# EAGLE schematic Main Board v14 (EAGLE 9.7.0)
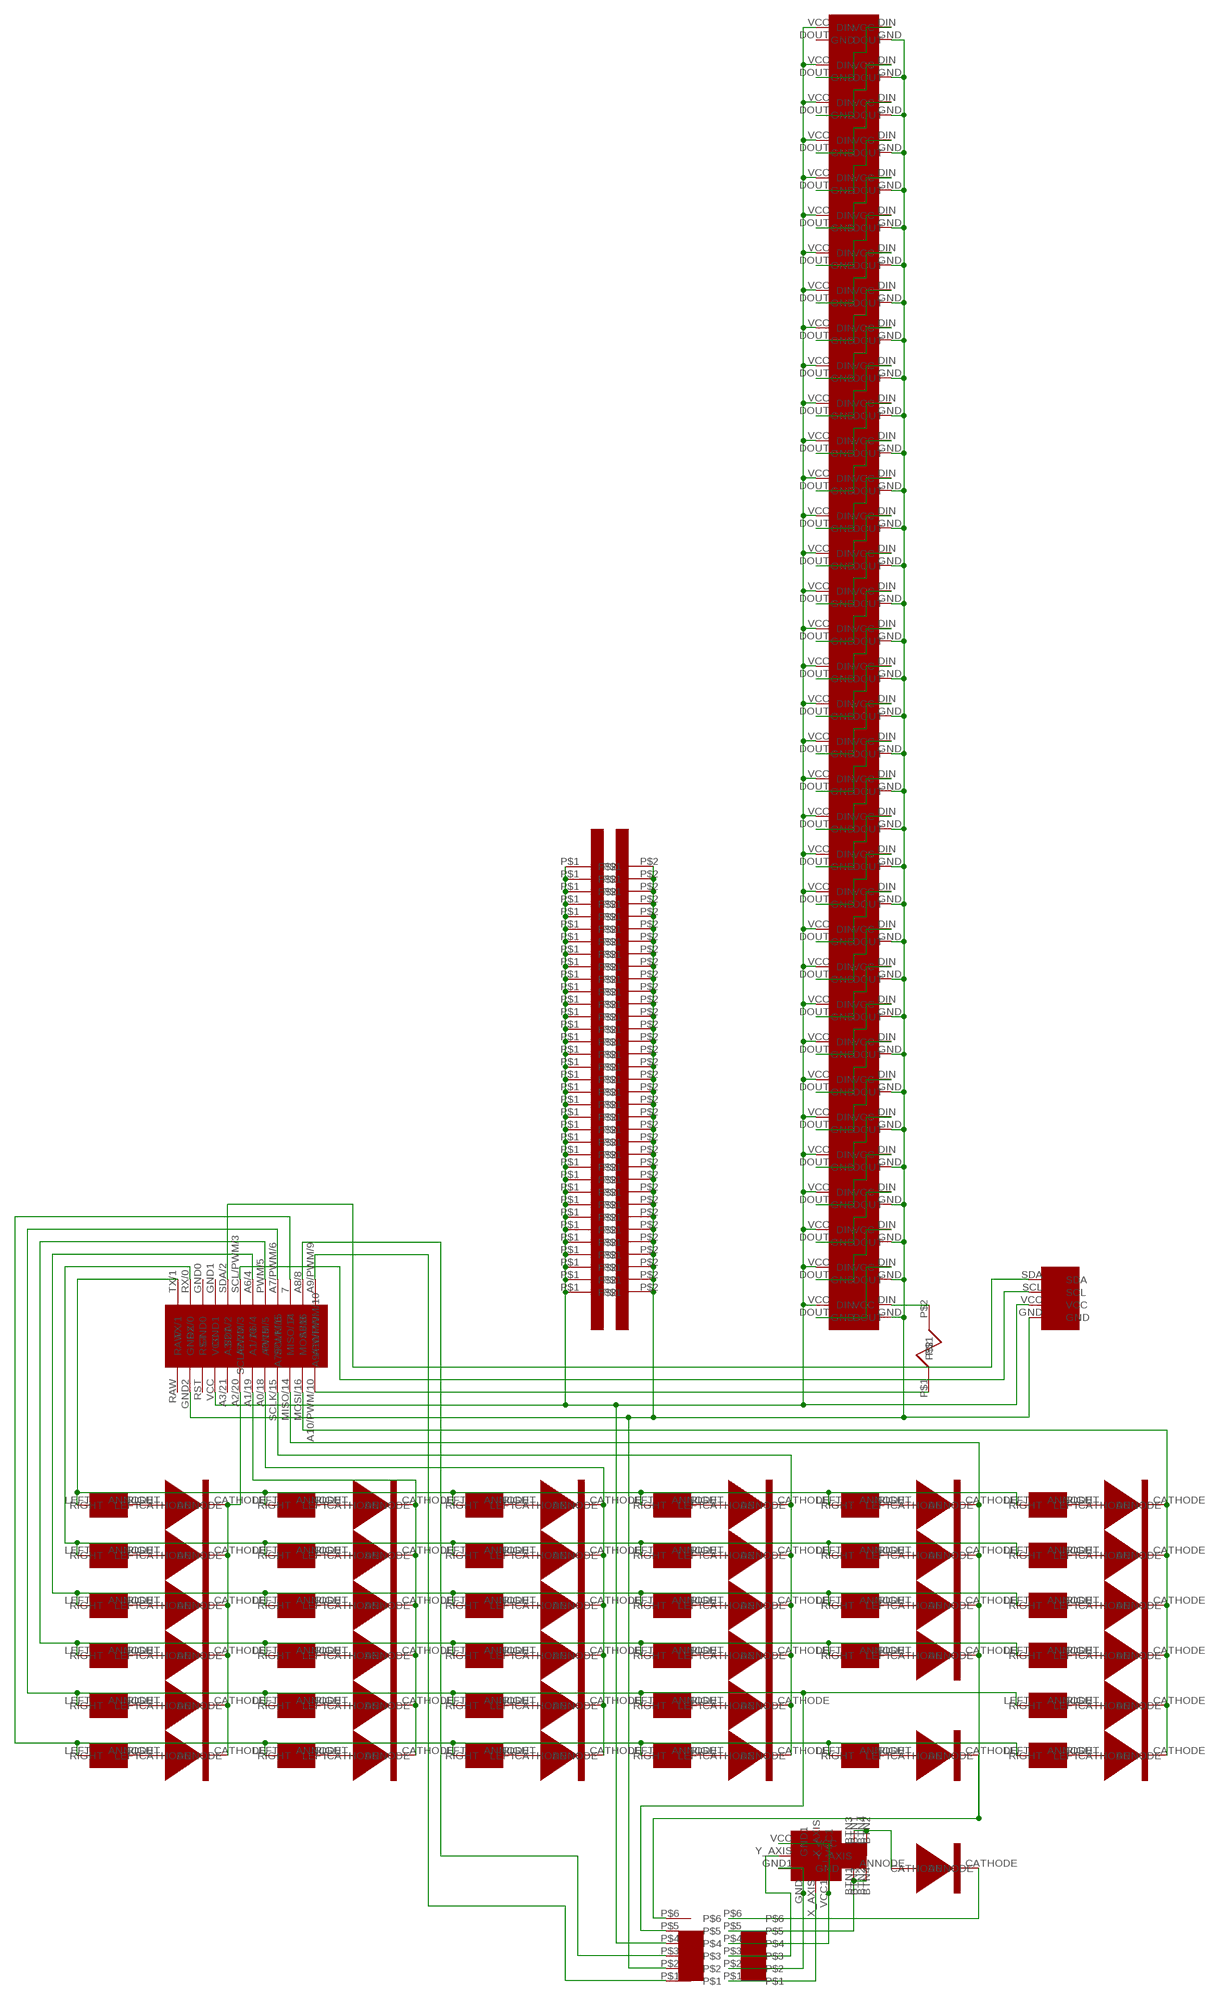
[diagram p0: schematic, sheet 1]

## Parts
1  HOTSWAP_SWITCH  [HOTSWAP_SWITCH]
2  HOTSWAP_SWITCH  [HOTSWAP_SWITCH]
3  HOTSWAP_SWITCH  [HOTSWAP_SWITCH]
4  HOTSWAP_SWITCH  [HOTSWAP_SWITCH]
5  HOTSWAP_SWITCH  [HOTSWAP_SWITCH]
A  HOTSWAP_SWITCH  [HOTSWAP_SWITCH]
ALT  HOTSWAP_SWITCH  [HOTSWAP_SWITCH]
B  HOTSWAP_SWITCH  [HOTSWAP_SWITCH]
C  HOTSWAP_SWITCH  [HOTSWAP_SWITCH]
CAPS  HOTSWAP_SWITCH  [HOTSWAP_SWITCH]
CTRL  HOTSWAP_SWITCH  [HOTSWAP_SWITCH]
D  HOTSWAP_SWITCH  [HOTSWAP_SWITCH]
E  HOTSWAP_SWITCH  [HOTSWAP_SWITCH]
ESC  HOTSWAP_SWITCH  [HOTSWAP_SWITCH]
F  HOTSWAP_SWITCH  [HOTSWAP_SWITCH]
F1  HOTSWAP_SWITCH  [HOTSWAP_SWITCH]
F2  HOTSWAP_SWITCH  [HOTSWAP_SWITCH]
F3  HOTSWAP_SWITCH  [HOTSWAP_SWITCH]
F4  HOTSWAP_SWITCH  [HOTSWAP_SWITCH]
F5  HOTSWAP_SWITCH  [HOTSWAP_SWITCH]
F6  HOTSWAP_SWITCH  [HOTSWAP_SWITCH]
FN  HOTSWAP_SWITCH  [HOTSWAP_SWITCH]
G  HOTSWAP_SWITCH  [HOTSWAP_SWITCH]
NISTOR  ARDUINO_PRO_MICRO  [ARDUINO_PRO_MICRO]
Q  HOTSWAP_SWITCH  [HOTSWAP_SWITCH]
R  HOTSWAP_SWITCH  [HOTSWAP_SWITCH]
S  HOTSWAP_SWITCH  [HOTSWAP_SWITCH]
SHIFT  HOTSWAP_SWITCH  [HOTSWAP_SWITCH]
SPACE  HOTSWAP_SWITCH  [HOTSWAP_SWITCH]
T  HOTSWAP_SWITCH  [HOTSWAP_SWITCH]
TAB  HOTSWAP_SWITCH  [HOTSWAP_SWITCH]
U$1  ANALOG_STICK  [ANALOG_STICK]
U$2  CAPACITOR  [CAPACITOR]
U$4  CAPACITOR  [CAPACITOR]
U$5  CAPACITOR  [CAPACITOR]
U$6  CAPACITOR  [CAPACITOR]
U$7  CAPACITOR  [CAPACITOR]
U$8  DIODE  [DIODE]
U$9  DIODE  [DIODE]
U$10  DIODE  [DIODE]
U$11  DIODE  [DIODE]
U$12  DIODE  [DIODE]
U$13  DIODE  [DIODE]
U$14  CAPACITOR  [CAPACITOR]
U$15  CAPACITOR  [CAPACITOR]
U$16  CAPACITOR  [CAPACITOR]
U$17  CAPACITOR  [CAPACITOR]
U$18  CAPACITOR  [CAPACITOR]
U$19  CAPACITOR  [CAPACITOR]
U$20  DIODE  [DIODE]
U$21  DIODE  [DIODE]
U$22  DIODE  [DIODE]
U$23  DIODE  [DIODE]
U$24  DIODE  [DIODE]
U$25  DIODE  [DIODE]
U$26  CAPACITOR  [CAPACITOR]
U$27  CAPACITOR  [CAPACITOR]
U$28  CAPACITOR  [CAPACITOR]
U$29  CAPACITOR  [CAPACITOR]
U$30  CAPACITOR  [CAPACITOR]
U$31  CAPACITOR  [CAPACITOR]
U$32  DIODE  [DIODE]
U$33  DIODE  [DIODE]
U$34  DIODE  [DIODE]
U$35  DIODE  [DIODE]
U$36  DIODE  [DIODE]
U$37  DIODE  [DIODE]
U$38  CAPACITOR  [CAPACITOR]
U$39  CAPACITOR  [CAPACITOR]
U$40  CAPACITOR  [CAPACITOR]
U$41  CAPACITOR  [CAPACITOR]
U$42  CAPACITOR  [CAPACITOR]
U$43  CAPACITOR  [CAPACITOR]
U$44  DIODE  [DIODE]
U$45  DIODE  [DIODE]
U$46  DIODE  [DIODE]
U$47  DIODE  [DIODE]
U$48  DIODE  [DIODE]
U$49  DIODE  [DIODE]
U$50  CAPACITOR  [CAPACITOR]
U$51  CAPACITOR  [CAPACITOR]
U$52  CAPACITOR  [CAPACITOR]
U$53  CAPACITOR  [CAPACITOR]
U$54  5_PIN_HEADER  [5_PIN_HEADER]
U$55  CAPACITOR  [CAPACITOR]
U$56  DIODE  [DIODE]
U$57  DIODE  [DIODE]
U$58  DIODE  [DIODE]
U$59  DIODE  [DIODE]
U$60  DIODE  [DIODE]
U$61  DIODE  [DIODE]
U$62  CAPACITOR  [CAPACITOR]
U$63  CAPACITOR  [CAPACITOR]
U$64  CAPACITOR  [CAPACITOR]
U$65  CAPACITOR  [CAPACITOR]
U$66  CAPACITOR  [CAPACITOR]
U$67  CAPACITOR  [CAPACITOR]
U$68  DIODE  [DIODE]
U$69  DIODE  [DIODE]
U$70  DIODE  [DIODE]
U$71  DIODE  [DIODE]
U$72  DIODE  [DIODE]
U$73  DIODE  [DIODE]
U$74  CAPACITOR  [CAPACITOR]
U$75  WS2812B  [WS2812B]
U$76  WS2812B  [WS2812B]
U$77  WS2812B  [WS2812B]
U$78  WS2812B  [WS2812B]
U$79  WS2812B  [WS2812B]
U$80  WS2812B  [WS2812B]
U$81  WS2812B  [WS2812B]
U$82  WS2812B  [WS2812B]
U$83  WS2812B  [WS2812B]
U$84  WS2812B  [WS2812B]
U$85  WS2812B  [WS2812B]
U$86  WS2812B  [WS2812B]
U$87  WS2812B  [WS2812B]
U$88  WS2812B  [WS2812B]
U$89  WS2812B  [WS2812B]
U$90  WS2812B  [WS2812B]
U$91  WS2812B  [WS2812B]
U$92  WS2812B  [WS2812B]
U$93  WS2812B  [WS2812B]
U$94  WS2812B  [WS2812B]
U$95  WS2812B  [WS2812B]
U$96  WS2812B  [WS2812B]
U$97  WS2812B  [WS2812B]
U$98  WS2812B  [WS2812B]
U$99  WS2812B  [WS2812B]
U$100  WS2812B  [WS2812B]
U$101  WS2812B  [WS2812B]
U$102  WS2812B  [WS2812B]
U$103  WS2812B  [WS2812B]
U$104  WS2812B  [WS2812B]
U$105  WS2812B  [WS2812B]
U$106  WS2812B  [WS2812B]
U$107  WS2812B  [WS2812B]
U$108  WS2812B  [WS2812B]
U$109  WS2812B  [WS2812B]
U$110  RESISTOR  [RESISTOR]
U$111  OLED_I2C  [OLED_I2C]
U$112  5_PIN_HEADER  [5_PIN_HEADER]
V  HOTSWAP_SWITCH  [HOTSWAP_SWITCH]
W  HOTSWAP_SWITCH  [HOTSWAP_SWITCH]
X  HOTSWAP_SWITCH  [HOTSWAP_SWITCH]
Z  HOTSWAP_SWITCH  [HOTSWAP_SWITCH]
~  HOTSWAP_SWITCH  [HOTSWAP_SWITCH]

## Nets
N$1: U$8.ANNODE ~.RIGHT
N$2: TAB.RIGHT U$9.ANNODE
N$3: CAPS.RIGHT U$10.ANNODE
N$4: SHIFT.RIGHT U$11.ANNODE
N$5: CTRL.RIGHT U$12.ANNODE
N$6: F6.RIGHT U$13.ANNODE
N$7: 1.RIGHT U$20.ANNODE
N$8: Q.RIGHT U$21.ANNODE
N$9: A.RIGHT U$22.ANNODE
N$10: U$23.ANNODE Z.RIGHT
N$11: FN.RIGHT U$24.ANNODE
N$12: F5.RIGHT U$25.ANNODE
N$13: 2.RIGHT U$32.ANNODE
N$14: U$33.ANNODE W.RIGHT
N$15: S.RIGHT U$34.ANNODE
N$16: U$35.ANNODE X.RIGHT
N$17: ALT.RIGHT U$36.ANNODE
N$18: F4.RIGHT U$37.ANNODE
N$19: 3.RIGHT U$44.ANNODE
N$20: E.RIGHT U$45.ANNODE
N$21: D.RIGHT U$46.ANNODE
N$22: C.RIGHT U$47.ANNODE
N$23: SPACE.RIGHT U$48.ANNODE
N$24: F3.RIGHT U$49.ANNODE
N$25: 4.RIGHT U$56.ANNODE
N$26: R.RIGHT U$57.ANNODE
N$27: F.RIGHT U$58.ANNODE
N$28: U$59.ANNODE V.RIGHT
N$29: U$1.BTN1 U$1.BTN2 U$112.P$5
N$30: F2.RIGHT U$61.ANNODE
N$31: 5.RIGHT U$68.ANNODE
N$32: T.RIGHT U$69.ANNODE
N$33: G.RIGHT U$70.ANNODE
N$34: B.RIGHT U$71.ANNODE
N$35: ESC.RIGHT U$72.ANNODE
N$36: F1.RIGHT U$73.ANNODE
N$37: NISTOR.A2/20 U$8.CATHODE U$9.CATHODE U$10.CATHODE U$11.CATHODE U$12.CATHODE U$13.CATHODE
N$38: NISTOR.A1/19 U$20.CATHODE U$21.CATHODE U$22.CATHODE U$23.CATHODE U$24.CATHODE U$25.CATHODE
N$39: NISTOR.A0/18 U$32.CATHODE U$33.CATHODE U$34.CATHODE U$35.CATHODE U$36.CATHODE U$37.CATHODE
N$40: NISTOR.SCLK/15 U$44.CATHODE U$45.CATHODE U$46.CATHODE U$47.CATHODE U$48.CATHODE U$49.CATHODE
N$41: NISTOR.MISO/14 U$54.P$6 U$56.CATHODE U$57.CATHODE U$58.CATHODE U$59.CATHODE U$61.CATHODE
N$42: NISTOR.MOSI/16 U$68.CATHODE U$69.CATHODE U$70.CATHODE U$71.CATHODE U$72.CATHODE U$73.CATHODE
N$43: 1.LEFT 2.LEFT 3.LEFT 4.LEFT 5.LEFT NISTOR.TX/1 ~.LEFT
N$44: E.LEFT NISTOR.RX/0 Q.LEFT R.LEFT T.LEFT TAB.LEFT W.LEFT
N$45: A.LEFT CAPS.LEFT D.LEFT F.LEFT G.LEFT NISTOR.A6/4 S.LEFT
N$46: B.LEFT C.LEFT NISTOR.PWM/5 SHIFT.LEFT V.LEFT X.LEFT Z.LEFT
N$47: U$1.X_AXIS U$112.P$1
N$48: F1.LEFT F2.LEFT F3.LEFT F4.LEFT F5.LEFT F6.LEFT NISTOR.7
N$49: NISTOR.VCC U$2.P$1 U$4.P$1 U$5.P$1 U$6.P$1 U$7.P$1 U$14.P$1 U$15.P$1 U$16.P$1 U$17.P$1 U$18.P$1 U$19.P$1 U$26.P$1 U$27.P$1 U$28.P$1 U$29.P$1 U$30.P$1 U$31.P$1 U$38.P$1 U$39.P$1 U$40.P$1 U$41.P$1 U$42.P$1 U$43.P$1 U$50.P$1 U$51.P$1 U$52.P$1 U$53.P$1 U$54.P$4 U$55.P$1 U$62.P$1 U$63.P$1 U$64.P$1 U$65.P$1 U$66.P$1 U$67.P$1 U$74.P$1 U$75.VCC U$76.VCC U$77.VCC U$78.VCC U$79.VCC U$80.VCC U$81.VCC U$82.VCC U$83.VCC U$84.VCC U$85.VCC U$86.VCC U$87.VCC U$88.VCC U$89.VCC U$90.VCC U$91.VCC U$92.VCC U$93.VCC U$94.VCC U$95.VCC U$96.VCC U$97.VCC U$98.VCC U$99.VCC U$100.VCC U$101.VCC U$102.VCC U$103.VCC U$104.VCC U$105.VCC U$106.VCC U$107.VCC U$108.VCC U$109.VCC U$111.VCC
N$50: NISTOR.GND2 U$2.P$2 U$4.P$2 U$5.P$2 U$6.P$2 U$7.P$2 U$14.P$2 U$15.P$2 U$16.P$2 U$17.P$2 U$18.P$2 U$19.P$2 U$26.P$2 U$27.P$2 U$28.P$2 U$29.P$2 U$30.P$2 U$31.P$2 U$38.P$2 U$39.P$2 U$40.P$2 U$41.P$2 U$42.P$2 U$43.P$2 U$50.P$2 U$51.P$2 U$52.P$2 U$53.P$2 U$54.P$2 U$55.P$2 U$62.P$2 U$63.P$2 U$64.P$2 U$65.P$2 U$66.P$2 U$67.P$2 U$74.P$2 U$75.GND U$76.GND U$77.GND U$78.GND U$79.GND U$80.GND U$81.GND U$82.GND U$83.GND U$84.GND U$85.GND U$86.GND U$87.GND U$88.GND U$89.GND U$90.GND U$91.GND U$92.GND U$93.GND U$94.GND U$95.GND U$96.GND U$97.GND U$98.GND U$99.GND U$100.GND U$101.GND U$102.GND U$103.GND U$104.GND U$105.GND U$106.GND U$107.GND U$108.GND U$109.GND U$111.GND
N$51: U$75.DOUT U$76.DIN
N$52: U$76.DOUT U$77.DIN
N$53: U$77.DOUT U$78.DIN
N$54: U$78.DOUT U$79.DIN
N$55: U$79.DOUT U$80.DIN
N$56: U$80.DOUT U$81.DIN
N$57: U$81.DOUT U$82.DIN
N$58: U$82.DOUT U$83.DIN
N$59: U$83.DOUT U$84.DIN
N$60: U$84.DOUT U$85.DIN
N$61: U$85.DOUT U$86.DIN
N$62: U$86.DOUT U$87.DIN
N$63: U$87.DOUT U$88.DIN
N$64: U$88.DOUT U$89.DIN
N$65: U$89.DOUT U$90.DIN
N$66: U$90.DOUT U$91.DIN
N$67: U$91.DOUT U$92.DIN
N$68: U$92.DOUT U$93.DIN
N$69: U$93.DOUT U$94.DIN
N$70: U$94.DOUT U$95.DIN
N$71: U$95.DOUT U$96.DIN
N$72: U$96.DOUT U$97.DIN
N$73: U$97.DOUT U$98.DIN
N$74: U$98.DOUT U$99.DIN
N$75: U$99.DOUT U$100.DIN
N$76: U$100.DOUT U$101.DIN
N$77: U$101.DOUT U$102.DIN
N$78: U$102.DOUT U$103.DIN
N$79: U$103.DOUT U$104.DIN
N$80: U$104.DOUT U$105.DIN
N$81: U$105.DOUT U$106.DIN
N$82: U$106.DOUT U$107.DIN
N$83: U$107.DOUT U$108.DIN
N$84: U$108.DOUT U$109.DIN
N$85: U$75.DIN U$110.P$2
N$86: NISTOR.A10/PWM/10 U$110.P$1
N$87: NISTOR.SCL/PWM/3 U$111.SCL
N$88: NISTOR.SDA/2 U$111.SDA
N$89: ALT.LEFT CTRL.LEFT ESC.LEFT FN.LEFT NISTOR.A7/PWM/6 SPACE.LEFT U$54.P$5
N$90: U$1.GND1(GND) U$1.GND(GND1) U$112.P$2
N$91: NISTOR.A9/PWM/9 U$54.P$1
N$92: NISTOR.A8/8 U$54.P$3
N$93: U$1.Y_AXIS U$112.P$3
N$94: U$1.VCC U$1.VCC1 U$112.P$4
N$95: U$1.BTN3 U$1.BTN4 U$60.ANNODE
N$96: U$60.CATHODE U$112.P$6
Unconnected: NISTOR.A3/21 NISTOR.GND0 NISTOR.GND1 NISTOR.RAW NISTOR.RST U$109.DOUT

## Library data of the parts
1-5 A ALT B C CAPS CTRL D E ESC F F1-F6 FN G Q R S SHIFT SPACE T TAB V W X Z ~ = Keyboard Parts Library:HOTSWAP_SWITCH
NISTOR = Keyboard Parts Library:ARDUINO_PRO_MICRO
U$1 = Keyboard Parts Library:ANALOG_STICK
U$2 U$4-U$7 U$14-U$19 U$26-U$31 U$38-U$43 U$50-U$53 U$55 U$62-U$67 U$74 = Keyboard Parts Library:CAPACITOR
U$8-U$13 U$20-U$25 U$32-U$37 U$44-U$49 U$56-U$61 U$68-U$73 = Keyboard Parts Library:DIODE
U$54 U$112 = Keyboard Parts Library:5_PIN_HEADER
U$75-U$109 = Keyboard Parts Library:WS2812B
U$110 = Keyboard Parts Library:RESISTOR
U$111 = Keyboard Parts Library:OLED_I2C